# EAGLE design controllerM1 (EAGLE 7.6.0)
CNAME: timebox controller; CREVISION: 1.0; DESIGNER: volzo
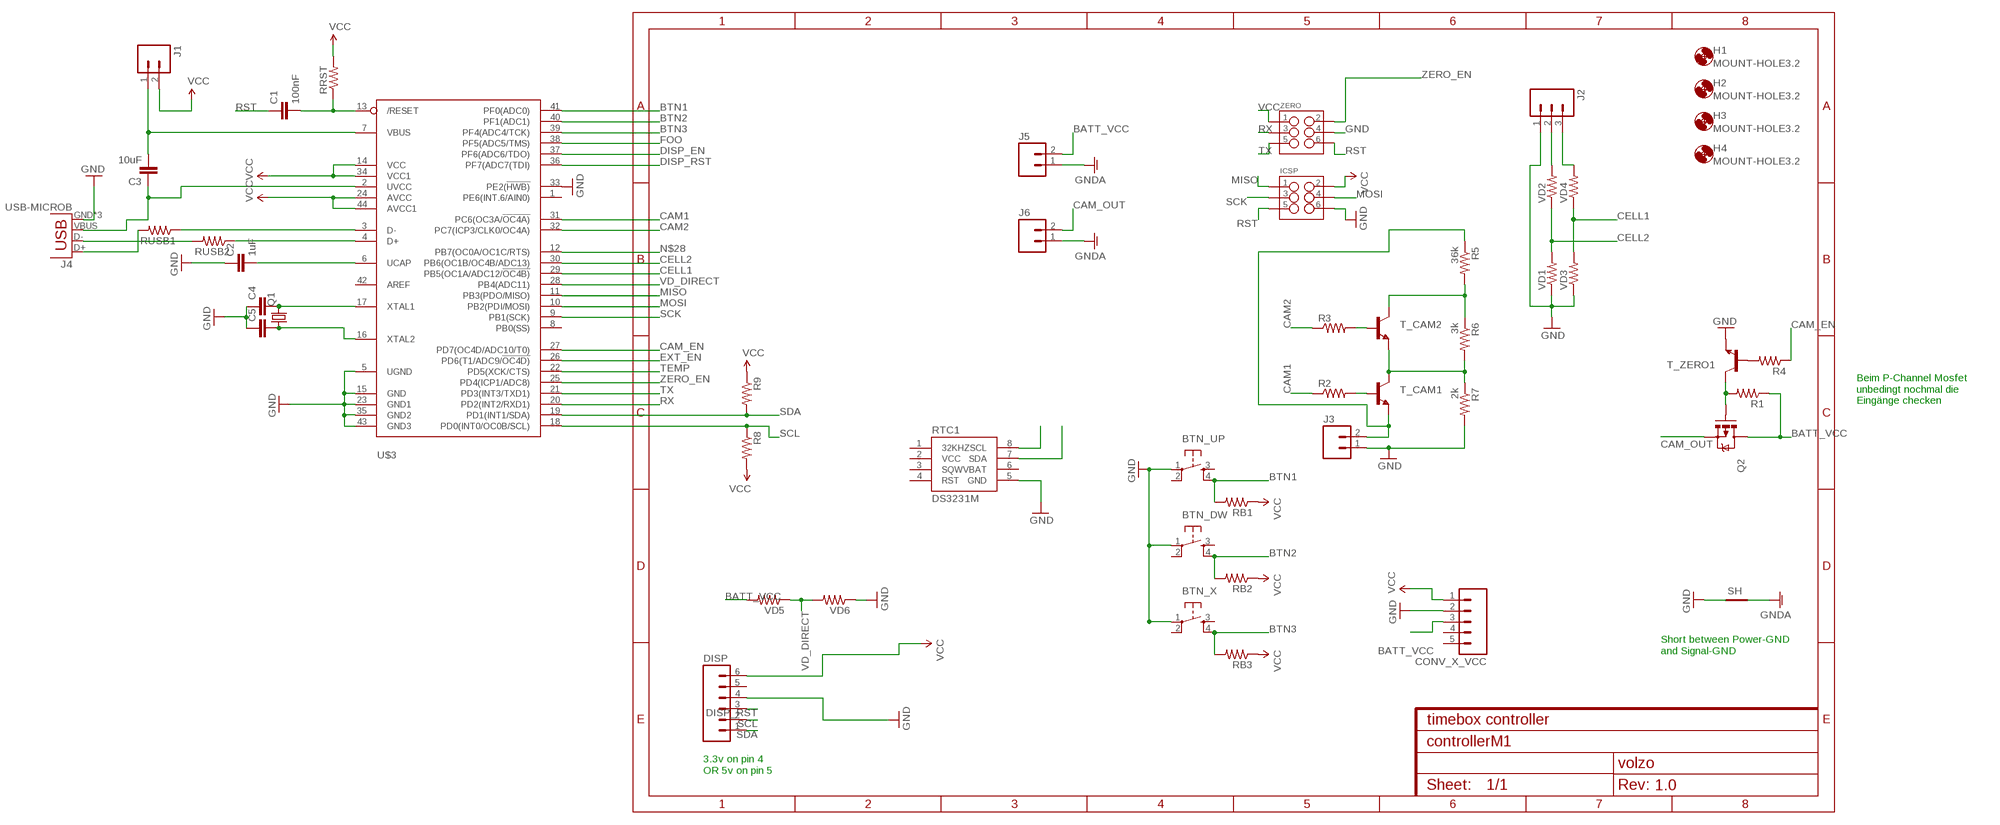
[diagram p0: schematic, sheet 1]

## Parts
BTN_DW  TAC_SWITCHPTH  [TACTILE-PTH]
BTN_UP  TAC_SWITCHPTH  [TACTILE-PTH]
BTN_X  TAC_SWITCHPTH  [TACTILE-PTH]
C1  100nF  CAP1206  [1206]
C2  1uF  CAP1206  [1206]
C3  10uF  CAP1206  [1206]
C4  CAP1206  [1206]
C5  CAP1206  [1206]
CONV_X_VCC  M05LOCK  [1X05_LOCK]
DISP  M06FEMALE_LOCK  [1X06_FEMALE_LOCK.010]
H1  MOUNT-HOLE3.2  [3,2]
H2  MOUNT-HOLE3.2  [3,2]
H3  MOUNT-HOLE3.2  [3,2]
H4  MOUNT-HOLE3.2  [3,2]
ICSP  M03X2FEMALE  [2X3]
J1  M02LOCK  [1X02_LOCK]
J2  M03LOCK  [1X03_LOCK]
J3  M02LOCK  [1X02_LOCK]
J4  USB-MICROB  [USB-MICROB]
J5  M023.5MM_LOCK  [SCREWTERMINAL-3.5MM-2_LOCK]
J6  M023.5MM_LOCK  [SCREWTERMINAL-3.5MM-2_LOCK]
Q1  CRYSTALHC49S  [HC49/S]
Q2  MOSFET-PCHANNELFQP27P06  [TO220V]
R1  RESISTOR1206  [1206]
R2  RESISTOR1206  [1206]
R3  RESISTOR1206  [1206]
R4  RESISTOR1206  [1206]
R5  36k  RESISTOR1206  [1206]
R6  3k  RESISTOR1206  [1206]
R7  2k  RESISTOR1206  [1206]
R8  RESISTOR1206  [1206]
R9  RESISTOR1206  [1206]
RB1  RESISTOR1206  [1206]
RB2  RESISTOR1206  [1206]
RB3  RESISTOR1206  [1206]
RRST  RESISTOR1206  [1206]
RTC1  DS3231M  [SOIC8]
RUSB1  RESISTOR1206  [1206]
RUSB2  RESISTOR1206  [1206]
SH  SHORT-HT5  [SHORT_TOP-50]
T_CAM1  TRANSISTOR_NPN2N3904  [TO-92]
T_CAM2  TRANSISTOR_NPN2N3904  [TO-92]
T_ZERO1  TRANSISTOR_NPN2N3904  [TO-92]
U$3  ATMEGA32U4-AU  [TQFP44]
VD1  RESISTOR1206  [1206]
VD2  RESISTOR1206  [1206]
VD3  RESISTOR1206  [1206]
VD4  RESISTOR1206  [1206]
VD5  RESISTOR1206  [1206]
VD6  RESISTOR1206  [1206]
ZERO  M03X2FEMALE  [2X3]

## Nets
BATT_VCC [power]: CONV_X_VCC.3 J5.2 Q2.2(D) R1.1 VD5.2
BTN1: BTN_UP.4 RB1.2 U$3.41(PF0(ADC0))
BTN2: BTN_DW.4 RB2.2 U$3.40(PF1(ADC1))
BTN3: BTN_X.4 RB3.2 U$3.39(PF4(ADC4/TCK))
CAM1: R2.1 U$3.31(PC6(OC3A/!OC4A))
CAM2: R3.1 U$3.32(PC7(ICP3/CLK0/OC4A))
CAM_EN: R4.1 U$3.27(PD7(OC4D/ADC10/T0))
CAM_OUT [power]: J6.2 Q2.3(S)
CELL1: U$3.29(PB5(OC1A/ADC12/!OC4B)) VD3.2 VD4.1
CELL2: U$3.30(PB6(OC1B/OC4B/ADC13)) VD1.2 VD2.1
DISP_EN: U$3.37(PF6(ADC6/TDO))
DISP_RST: DISP.3 U$3.36(PF7(ADC7(TDI))
EXT_EN: U$3.26(PD6(T1/ADC9/!OC4D))
FOO: U$3.38(PF5(ADC5/TMS))
GND: BTN_DW.1 BTN_UP.1 BTN_X.1 C2.1 C4.1 C5.1 CONV_X_VCC.2 DISP.4 ICSP.6 J2.1 J3.1 J4.GND J4.MT1(GND) J4.MT2(GND) R7.2 RTC1.5(GND) SH.1 T_ZERO1.1(E) U$3.5(UGND) U$3.15(GND) U$3.23(GND1) U$3.33(PE2(!HWB)) U$3.35(GND2) U$3.43(GND3) VD1.1 VD3.1 VD6.1 ZERO.4
GNDA [power]: J5.1 J6.1 SH.2
MISO: ICSP.1 U$3.11(PB3(PDO/MISO))
MOSI: ICSP.4 U$3.10(PB2(PDI/MOSI))
N$1: C1.2 RRST.1 U$3.13(/RESET)
N$2: J2.3 VD4.2
N$3: J2.2 VD2.2
N$4: RUSB1.1 U$3.3(D-)
N$5: RUSB2.1 U$3.4(D+)
N$6: J3.2 R5.1 T_CAM1.1(E)
N$7: R4.2 T_ZERO1.2(B)
N$8: C4.2 Q1.2 U$3.17(XTAL1)
N$9: C5.2 Q1.1 U$3.16(XTAL2)
N$10: C3.2 J1.1 U$3.7(VBUS)
N$12: R6.2 R7.1 T_CAM1.3(C) T_CAM2.1(E)
N$13: R5.2 R6.1 T_CAM2.3(C)
N$14: J4.D+ RUSB1.2
N$15: J4.D- RUSB2.2
N$18: R2.2 T_CAM1.2(B)
N$19: R3.2 T_CAM2.2(B)
N$20: C2.2 U$3.6(UCAP)
N$21: Q2.1(G) R1.2 T_ZERO1.3(C)
N$22: C3.1 J4.VBUS U$3.2(UVCC)
N$28: U$3.12(PB7(OC0A/OC1C/RTS))
RST: C1.1 ICSP.5 ZERO.6
RX: U$3.20(PD2(INT2/RXD1)) ZERO.3
SCK: ICSP.3 U$3.9(PB1(SCK))
SCL: DISP.2 R8.1 RTC1.8(SCL) U$3.18(PD0(INT0/OC0B/SCL))
SDA: DISP.1 R9.2 RTC1.7(SDA) U$3.19(PD1(INT1/SDA))
TEMP: U$3.22(PD5(XCK/CTS))
TX: U$3.21(PD3(INT3/TXD1)) ZERO.5
VCC: CONV_X_VCC.1 DISP.6 ICSP.2 J1.2 R8.2 R9.1 RB1.1 RB2.1 RB3.1 RRST.2 U$3.14(VCC) U$3.24(AVCC) U$3.34(VCC1) U$3.44(AVCC1) ZERO.1
VD_DIRECT: U$3.28(PB4(ADC11)) VD5.1 VD6.2
ZERO_EN: U$3.25(PD4(ICP1/ADC8)) ZERO.2
Unconnected: BTN_DW.2 BTN_DW.3 BTN_UP.2 BTN_UP.3 BTN_X.2 BTN_X.3 CONV_X_VCC.4 CONV_X_VCC.5 DISP.5 RTC1.1(32KHZ) RTC1.3(SQW) RTC1.4(RST) U$3.1(PE6(INT.6/AIN0)) U$3.8(PB0(SS)) U$3.42(AREF)

## Notes on the sheet
- Beim P-Channel Mosfet
  unbedingt nochmal die 
  Eingänge checken
- Short between Power-GND
  and Signal-GND
- 3.3v on pin 4
  OR 5v on pin 5

## Power pins joined to a net without a drawn wire
VBAT: RTC1.6(VBAT)
VCC: RTC1.2(VCC)

## Library data of the parts
BTN_DW BTN_UP BTN_X = SparkFun-Retired:TAC_SWITCH: Momentary Switch Button commonly used for reset or general input. Spark Fun Electronics SKU : COM-00097 SMT- SWCH-08247
C1 C3-C5 = SparkFun-Passives:CAP: Capacitor Standard 0603 ceramic capacitor, and 0.1" leaded capacitor.
C2 = SparkFun-Capacitors:CAP: Capacitor Standard 0603 ceramic capacitor, and 0.1" leaded capacitor.
CONV_X_VCC = SparkFun-Connectors:M05: Header 5 Standard 5-pin 0.1" header. Use with straight break away headers (SKU : PRT-00116), right angle break away headers (PRT-00553), swiss pins (PRT-00743), machine pins (PRT-00117), and female headers (PRT-00115). Molex polarized connector foot print use with SKU : PRT-08230 with associated crimp pins and housings.
DISP = SparkFun-Connectors:M06: Header 6 Standard 6-pin 0.1" header. Use with straight break away headers (SKU : PRT-00116), right angle break away headers (PRT-00553), swiss pins (PRT-00743), machine pins (PRT-00117), and female headers (PRT-00115). Molex polarized connector foot print use with SKU : PRT-08094 with associated crimp pins and housings. NOTES ON THE VARIANTS LOCK and LOCK_LONGPADS... This footprint was designed to help hold the alignment of a through-hole component (i.e. 6-pin header) while soldering it into place. You may notice that each hole has been shifted either up or down by 0.005 of an inch from it's more standard position (which is a perfectly straight line). This slight alteration caused the pins (the squares in the middle) to touch the edges of the holes. Because they are alternating, it causes a "brace" to hold the component in place. 0.005 has proven to be the perfect amount of "off-center" position when using our standard breakaway headers. Although looks a little odd when you look at the bare footprint, once you have a header in there, the alteration is very hard to notice. Also,if you push a header all the way into place, it is covered up entirely on the bottom side. This idea of altering the position of holes to aid alignment will be further integrated into the Sparkfun Library for other footprints. It can help hold any component with 3 or more connection pins.
H1-H4 = holes:MOUNT-HOLE: MOUNTING HOLE with drill center marker
ICSP ZERO = SparkFun-Connectors:M03X2: 2x3 .1" header. Shrouded, with keying- CONN-10681 SMT- CONN-11415 Pogo pins- HW-11044; PROD_ID: CONN-11566; VALUE: FEMALE 2x3
J1 J3 = SparkFun-Connectors:M02: Standard 2-pin 0.1" header. Use with - straight break away headers ( PRT-00116) - right angle break away headers (PRT-00553) - swiss pins (PRT-00743) - machine pins (PRT-00117) - female headers (PRT-00115) Molex polarized connector foot print use with: PRT-08233 with associated crimp pins and housings. 2.54_SCREWTERM for use with PRT-10571. 3.5mm Screw Terminal footprints for PRT-08084 5mm Screw Terminal footprints for use with PRT-08432
J2 = SparkFun-Connectors:M03: Header 3 Standard 3-pin 0.1" header. Use with straight break away headers (SKU : PRT-00116), right angle break away headers (PRT-00553), swiss pins (PRT-00743), machine pins (PRT-00117), and female headers (PRT-00115). Molex polarized connector foot print use with SKU : PRT-08232 with associated crimp pins and housings.
J4 = SparkFun-Connectors:USB: USB Connectors USB-B-PTH is fully proven SKU : PRT-00139/CONN-08278 USB-miniB is fully proven SKU : PRT-00587 USB-A-PCB is untested. USB-A-H is throughly reviewed, but untested. Spark Fun Electronics SKU : PRT-00437 USB-B-SMT is throughly reviewed, but untested. Needs silkscreen touching up. USB-A-S has not been used/tested USB-MB-H has not been used/tested USB-MICROB has been used. CONN-09505; PROD_ID: CONN-09505
J5 J6 = SparkFun-Connectors:M02: Standard 2-pin 0.1" header. Use with - straight break away headers ( PRT-00116) - right angle break away headers (PRT-00553) - swiss pins (PRT-00743) - machine pins (PRT-00117) - female headers (PRT-00115) Molex polarized connector foot print use with: PRT-08233 with associated crimp pins and housings. 2.54_SCREWTERM for use with PRT-10571. 3.5mm Screw Terminal footprints for PRT-08084 5mm Screw Terminal footprints for use with PRT-08432; PROD_ID: CONN-08399
Q1 = adafruit:CRYSTAL: CRYSTAL; OC_FARNELL: 1667008; OC_NEWARK: unknown
Q2 = SparkFun-DiscreteSemi:MOSFET-PCHANNEL: Generic PMOSFET IRLML2244 - TRANS-11153 (SOT-23 -20V -4.3A) (1.Gate 2.Source 3.Drain) FQP27P06 - COM-10349 <http://www.sparkfun.com/products/10349> (TO-220 -60V -27A) (1.Gate 2.Source 3.Drain)
R1-R9 RB1-RB3 RRST RUSB1 RUSB2 VD1-VD6 = SparkFun-Passives:RESISTOR: Resistor Basic schematic elements and footprints for 0603, 1206, and PTH resistors.
RTC1 = SparkFun-DigitalIC:DS3231M: DS3231M Real Time Clock. Accuracy +/-5ppm. Battery Backup. 2.3V to 5.5V.; PROD_ID: IC-11985
SH = shorts-old:SHORT-H: Short between two nets; BOM: no
T_CAM1 T_CAM2 T_ZERO1 = SparkFun-DiscreteSemi:TRANSISTOR_NPN: Generic NPN BJT MMBT2222A - TRANS-08049 (SOT-23, 1A 40V) MPSA42 - TRANS-09116 (SOT-23, 500mA 300V) MMBT5088LT1G - TRANS-11160 (SOT-23, 50 mA 30V) BC547 - COM-08928 <http://www.sparkfun.com/products/8928> (TO-92 45V 100mA) (1.Collector 2.Base 3.Emitter) 2N3904 - COM-00521 <http://www.sparkfun.com/products/521> (TO-92 40V 200mA) (1.Emitter 2.Base 3.Collector) P2N2222A - COM-12852 <http://www.sparkfun.com/products/12852> (TO-92 40V 600mA) (1.Collector 2.Base 3.Emitter); PROD_ID: TRANS-08447
U$3 = adafruit:ATMEGA32U4: http://www.ladyada.net/library/eagle

## Net classes
0 default: width 0.254 mm
1 power: width 0.762 mm, clearance 0.254 mm

## Board
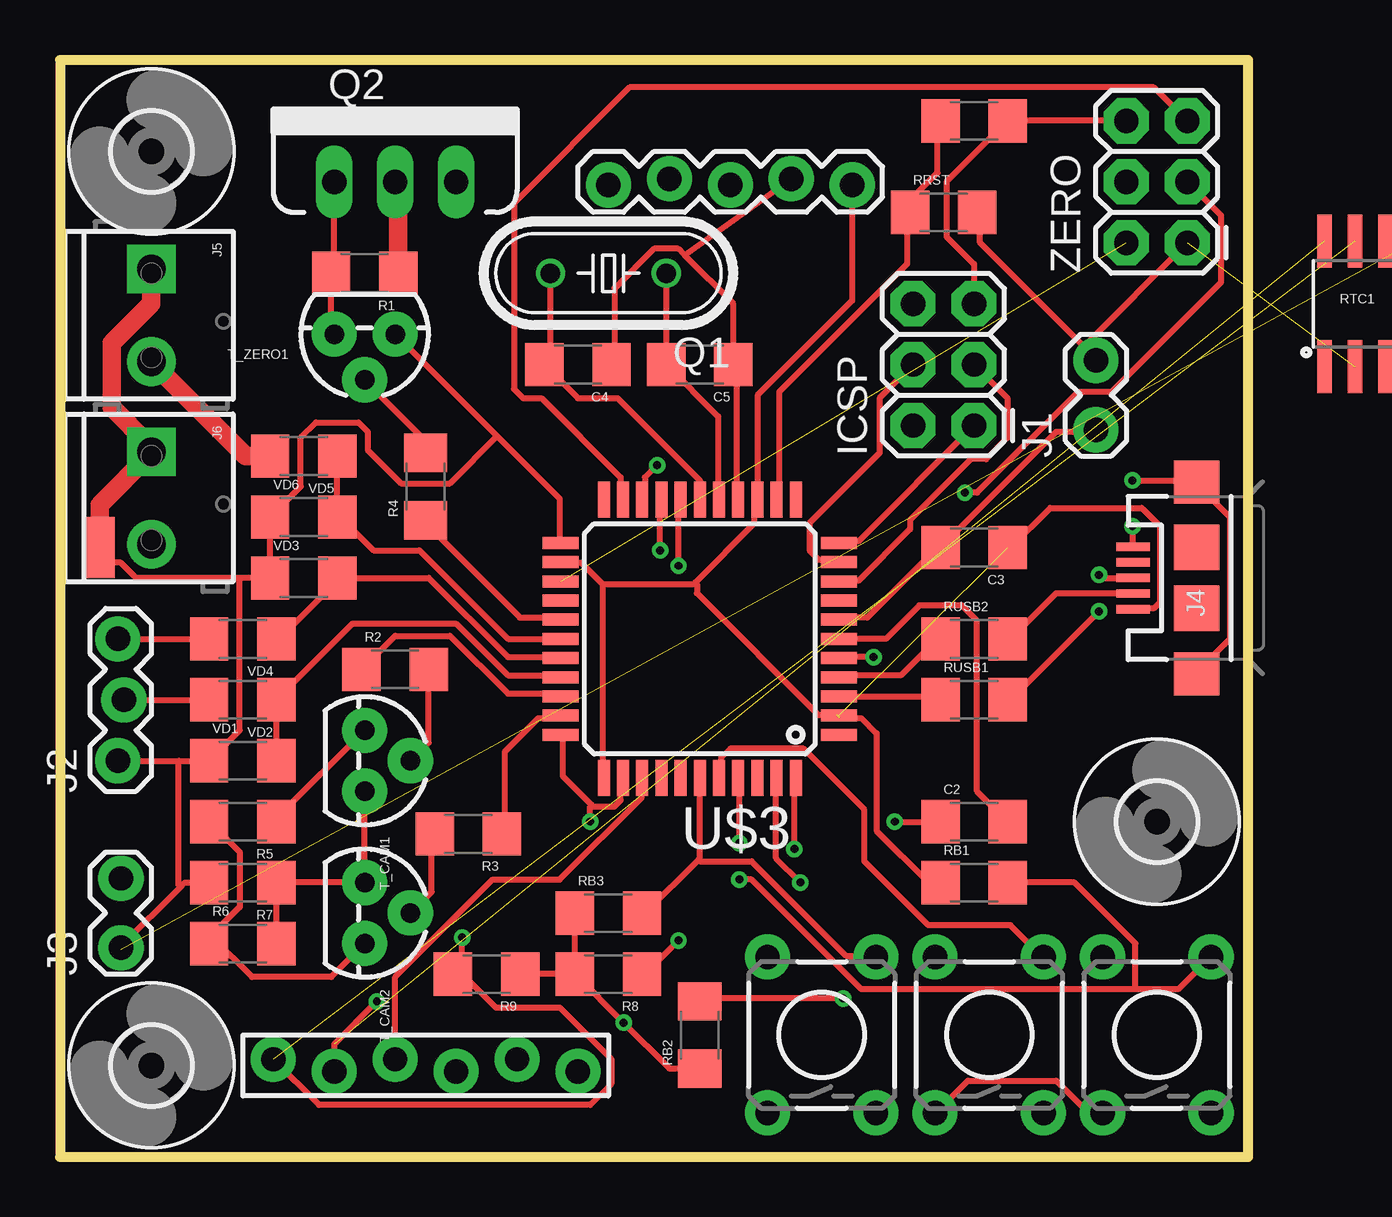
[diagram p1: board, top side]
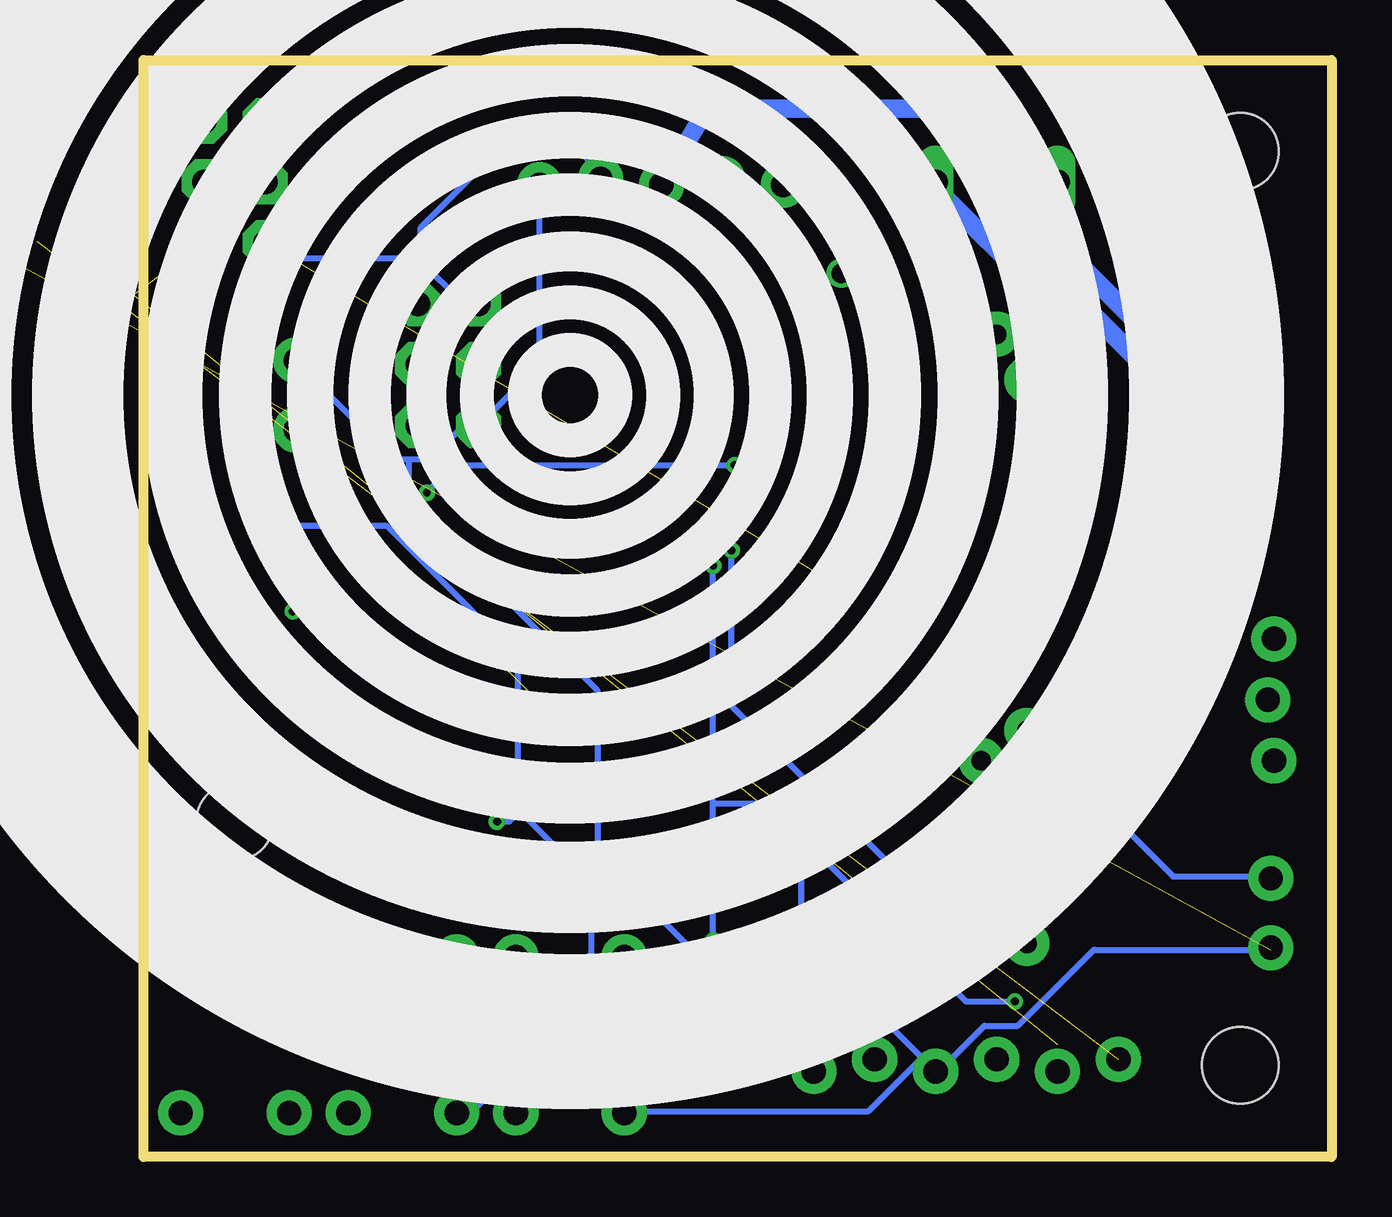
[diagram p2: board, bottom side, seen from below]

Size 49.53 x 45.72 mm. Coordinates in mm from the lower left corner, seen from the top.
Outline: 0,0 49.53,0 49.53,45.72 0,45.72 0,0
Copper layers (1*16): Top 0.0356mm / dielectric 1.5011mm / Bottom 0.0356mm
Design rules "oshpark-2layer *": minimum track width 6mil, minimum drill 13mil, track to track 10mil, track to pad 10mil, pad to pad 10mil, via to via 10mil, smd to smd 10mil, copper to edge 15mil, drill to drill 6mil, minimum pad ring 7mil, minimum via ring 7mil, stop-mask expansion 2.5mil, vias tented up to drill 0mil, thermal gap 10mil

### Footprints (pad centres in the part's own frame; a part is rotated, then mirrored left to right if it is on the bottom)
TACTILE-PTH = drill 1.016 pad 1.88: 1 -3.251,2.261; 2 3.251,2.261; 3 -3.251,-2.261; 4 3.251,-2.261
1206 = smd 1.6 x 1.8: 1 -1.4,0; 2 1.4,0
1X05_LOCK = drill 1.016 pad 1.88: 1 0,0.127; 2 2.54,-0.127; 3 5.08,0.127; 4 7.62,-0.127; 5 10.16,0.127
1X06_FEMALE_LOCK.010 = drill 1.016 pad 1.88: 1 0,0.254; 2 2.54,-0.254; 3 5.08,0.254; 4 7.62,-0.254; 5 10.16,0.254; 6 12.7,-0.254
3,2 = hole 3.2: 0,0
2X3 = drill 1.016 pad 1.88 octagon: 1 0,0; 2 0,2.54; 3 2.54,0; 4 2.54,2.54; 5 5.08,0; 6 5.08,2.54
1X02_LOCK = drill 1.016 pad 1.88: 1 -0.178,0; 2 2.718,0
1X03_LOCK = drill 1.016 pad 1.88: 1 0,0.127; 2 2.54,-0.127; 3 5.08,0.127
USB-MICROB = smd 0.35 x 1.4: D+ 0,2.65; D- -0.65,2.65; GND 1.3,2.65; ID 0.65,2.65; VBUS -1.3,2.65 | smd 1.8 x 1.9: MT1 -4,0; MT2 4,0 | smd 1.9 x 1.9: P$1 -1.27,0; P$2 1.27,0
SCREWTERMINAL-3.5MM-2_LOCK = drill 1.2 pad 2.032 square: 1 -0.178,0 | drill 1.2 pad 2.032: 2 3.678,0
HC49/S = drill 0.813: 1 -2.413,0; 2 2.413,0
TO220V = drill 1.016 long: 1 -2.54,0; 2 0,0; 3 2.54,0
SOIC8 = smd 0.61 x 2.21: 1 -1.905,-2.616; 2 -0.635,-2.616; 3 0.635,-2.616; 4 1.905,-2.616; 5 1.905,2.616; 6 0.635,2.616; 7 -0.635,2.616; 8 -1.905,2.616
SHORT_TOP-50 = smd 1.27 x 1.27: 1 0.635,0; 2 -0.635,0
TO-92 = drill 0.813 pad 1.88: 1 -1.27,0; 2 0,1.905; 3 1.27,0
TQFP44 = smd 1.5 x 0.5: 1 -5.8,4; 2 -5.8,3.2; 3 -5.8,2.4; 4 -5.8,1.6; 5 -5.8,0.8; 6 -5.8,0; 7 -5.8,-0.8; 8 -5.8,-1.6; 9 -5.8,-2.4; 10 -5.8,-3.2; 11 -5.8,-4; 23 5.8,-4; 24 5.8,-3.2; 25 5.8,-2.4; 26 5.8,-1.6; 27 5.8,-0.8; 28 5.8,0; 29 5.8,0.8; 30 5.8,1.6; 31 5.8,2.4; 32 5.8,3.2; 33 5.8,4 | smd 0.5 x 1.5: 12 -4,-5.8; 13 -3.2,-5.8; 14 -2.4,-5.8; 15 -1.6,-5.8; 16 -0.8,-5.8; 17 0,-5.8; 18 0.8,-5.8; 19 1.6,-5.8; 20 2.4,-5.8; 21 3.2,-5.8; 22 4,-5.8; 34 4,5.8; 35 3.2,5.8; 36 2.4,5.8; 37 1.6,5.8; 38 0.8,5.8; 39 0,5.8; 40 -0.8,5.8; 41 -1.6,5.8; 42 -2.4,5.8; 43 -3.2,5.8; 44 -4,5.8

### Placement (x,y rotation side)
BTN_DW  38.73,5.08 90 top
BTN_UP  45.72,5.08 90 top
BTN_X  31.75,5.08 90 top
C1  38.1,43.18 180 top
C2  38.1,13.97 0 top
C3  38.1,25.4 180 top
C4  21.59,33.02 180 top
C5  26.67,33.02 180 top
CONV_X_VCC  33.02,40.64 180 top
DISP  8.89,3.81 0 top
H1  3.81,41.91 0 top
H2  45.72,13.97 0 top
H3  69.85,27.94 0 top  (outside the outline)
H4  3.81,3.81 0 top
ICSP  38.1,30.48 90 top
J1  43.18,30.48 90 top
J2  2.54,16.51 90 top
J3  2.54,8.89 90 top
J4  47.37,24.13 90 top
J5  3.81,36.83 270 top
J6  3.81,29.21 270 top
Q1  22.86,36.83 180 top
Q2  13.97,40.64 0 top
R1  12.7,36.83 180 top
R2  13.97,20.32 0 top
R3  17.02,13.46 180 top
R4  15.24,27.94 90 top
R5  7.62,13.97 180 top
R6  7.62,8.89 0 top
R7  7.62,11.43 180 top
R8  22.86,7.62 180 top
R9  17.78,7.62 180 top
RB1  38.1,11.43 0 top
RB2  26.67,5.08 90 top
RB3  22.86,10.16 0 top
RRST  36.83,39.37 0 top
RTC1  54.61,35.56 0 top  (outside the outline)
RUSB1  38.1,19.05 0 top
RUSB2  38.1,21.59 0 top
SH  1.65,25.4 270 top
T_CAM1  12.7,16.51 270 top
T_CAM2  12.7,10.16 270 top
T_ZERO1  12.7,34.29 180 top
U$3  26.67,21.59 180 top
VD1  7.62,16.51 0 top
VD2  7.62,19.05 180 top
VD3  10.16,24.13 0 top
VD4  7.62,21.59 180 top
VD5  10.16,29.21 180 top
VD6  10.16,26.67 0 top
ZERO  46.99,38.1 90 top

### Tracks (layer width: path | path; a pad name or v marks a point on that pad's centre or on a via)
BATT_VCC
  Top 0.762: VD5.2 7.75,29.21 J5.2 | Q2.2 14.1,40.51 R1.1
  Bottom 0.762: CONV_X_VCC.3 26.04,43.69 16.76,43.69 13.97,40.89 Q2.2 13.97,40.39 12.06,38.48 11.81,38.48 6.6,33.27 3.81,33.27 J5.2
BTN1  (via drill 0.33)
  Top 0.254: v28.32,13.08 28.32,15.75 U$3.41 | v28.32,11.56 28.83,11.56 33.4,6.99 44.83,6.99 | 44.83,6.99 46.61,6.99 47.88,8.26 BTN_UP.4 | RB1.2 42.29,11.43 44.83,8.89 44.83,6.99
  Bottom 0.254: v28.32,11.56 v28.32,13.08
BTN2  (via drill 0.33)
  Top 0.254: U$3.40 27.56,15.88 27.56,16.64 27.94,17.02 30.99,17.02 33.53,14.48 33.53,12.32 36.2,9.65 39.62,9.65 40.89,8.38 BTN_DW.4 | v32.64,6.6 26.67,6.6 RB2.2
  Bottom 0.254: v32.64,6.6 39.24,6.6 40.89,8.26 BTN_DW.4
BTN3
  Top 0.254: U$3.39 26.67,12.45 26.61,12.38 | 26.61,12.38 24.38,10.16 RB3.2 | BTN_X.4 33.91,8.38 32.77,8.38 28.83,12.32 26.67,12.32 26.61,12.38
CAM1
  Top 0.254: U$3.31 20.83,19.3 18.67,19.3 16.26,21.72 13.97,21.72 R2.1
CAM2
  Top 0.254: U$3.32 20.83,18.29 19.94,18.29 18.54,16.89 18.54,13.46 R3.1
CAM_EN
  Top 0.254: U$3.27 20.83,22.48 19.18,22.48 15.24,26.42 R4.1
CAM_OUT
  Bottom 0.762: Q2.3 16.51,40.39 12.06,35.94 10.79,35.94 5.46,30.61 5.46,27.3 3.81,25.65 J6.2
CELL1
  Top 0.254: 11.68,24.13 15.37,24.13 18.67,20.83 20.83,20.83 U$3.29 | 11.68,24.13 9.14,21.59 VD4.1 | 11.68,24.13 VD3.2
CELL2
  Top 0.254: VD2.1 12.19,22.23 16.51,22.23 18.67,20.07 20.83,20.07 U$3.30 | VD2.1 VD1.2 | VD2.1
DISP_RST
  Top 0.254: DISP.3 13.97,7.49 18.03,11.56 20.83,11.56 24.26,14.99 24.26,15.75 U$3.36
GND  (via drill 0.33)  (1 unrouted)
  Top 0.254: T_ZERO1.1 18.22,30.04 | 18.22,30.04 20.83,27.43 20.83,25.65 U$3.23 | SH.1 2.54,24.77 3.17,24.13 7.49,24.13 | 7.49,24.13 VD3.1 VD6.1 | J2.1 4.95,16.51 | 4.95,16.51 VD1.1 7.49,17.78 7.49,24.13 | R7.2 5.21,11.43 5.02,11.24 | 5.02,11.24 2.54,8.76 J3.1 | 4.95,16.51 4.95,11.3 5.02,11.24 | 18.22,30.04 16.26,28.07 14.22,28.07 12.83,29.46 12.83,30.23 12.45,30.61 10.67,30.61 10.03,29.97 10.03,27.94 VD6.1 | VD6.1 | U$3.15 28.19,27.43 28.19,33.02 C5.1 28.07,35.56 26.04,37.59 | 26.04,37.59 25.78,37.85 24.77,37.85 23.11,36.2 23.11,33.02 C4.1 | 26.04,37.59 CONV_X_VCC.2 | J4.MT1 47.37,20.19 48.77,21.59 48.77,26.67 47.37,28.07 J4.MT2 47.37,28.19 v44.7,28.19 | v44.7,26.29 44.7,25.53 J4.GND | 22.16,14.67 20.95,15.88 20.95,17.53 U$3.33 | 22.16,14.67 22.23,14.61 23.11,14.61 23.37,14.86 23.37,15.75 U$3.35 | v22.1,13.97 22.1,14.61 22.16,14.67 | v30.86,11.43 29.84,12.45 29.84,15.75 U$3.43 | v33.91,20.83 32.51,20.83 U$3.5 | v34.8,13.97 C2.1 | BTN_UP.1 43.43,1.91 42.8,1.91 41.53,3.17 37.85,3.17 36.58,1.91 BTN_DW.1
  Bottom 0.254: 43.12,37.53 43.05,37.59 43.05,39.24 ZERO.4 | 43.12,37.53 44.7,35.94 v44.7,28.19 v44.7,26.29 39.37,26.29 v33.91,20.83 33.91,14.48 33.85,14.41 | ICSP.6 36.2,35.56 38.04,37.4 | 38.04,37.4 38.1,37.47 43.05,37.47 43.12,37.53 | CONV_X_VCC.2 31.37,42.04 32.51,43.18 33.53,43.18 37.97,38.73 37.97,37.47 38.04,37.4 | v22.1,13.97 22.1,9.14 DISP.4 | 30.86,3.17 v30.86,11.43 33.85,14.41 | 30.86,3.17 29.59,1.91 BTN_X.1 29.46,1.91 19.3,1.91 17.14,4.06 DISP.4 | v34.8,13.97 34.29,13.97 33.85,14.41 | 30.86,3.17 34.54,3.17 35.81,1.91 36.45,1.91 BTN_DW.1 | J3.1 2.54,8.64 9.91,8.64 13.08,5.46 14.48,5.46 16.38,3.56 DISP.4
GNDA
  Top 0.762: SH.2 1.65,27.18 3.81,29.34 J6.1 3.68,29.72 2.16,31.24 2.16,33.91 3.81,35.56 J5.1
MISO
  Top 0.254: ICSP.1 33.27,25.65 32.51,25.65 U$3.11
MOSI
  Top 0.254: ICSP.4 34.16,31.62 34.16,29.34 31.24,26.42 31.24,25.27 31.62,24.89 32.38,24.89 U$3.10
N$1
  Top 0.254: U$3.13 29.97,27.43 29.97,31.88 35.31,37.21 35.31,39.37 RRST.1 35.43,39.88 36.58,41.02 36.58,43.18 C1.2
N$2
  Top 0.254: J2.3 VD4.2
N$3
  Top 0.254: J2.2 VD2.2
N$4
  Top 0.254: U$3.3 32.51,19.18 36.45,19.18 36.58,19.05 RUSB1.1
N$5
  Top 0.254: U$3.4 32.51,20.07 35.05,20.07 36.58,21.59 RUSB2.1
N$6
  Top 0.254: T_CAM1.1 9.14,14.22 9.14,13.97 R5.1
  Bottom 0.254: T_CAM1.1 6.6,11.68 2.54,11.68 J3.2
N$7
  Top 0.254: R4.2 15.24,29.84 T_ZERO1.2
N$8
  Top 0.254: U$3.17 26.67,28.19 23.24,31.62 21.59,31.62 C4.2 20.45,32.89 Q1.2
N$9
  Top 0.254: C5.2 27.43,30.86 27.43,27.43 U$3.16 | C5.2 Q1.1 | C5.2
N$10
  Top 0.254: U$3.7 32.51,22.48 33.66,22.48 36.58,25.4 C3.2 41.53,30.23 43.18,30.23 J1.1
N$12
  Top 0.254: R6.2 R7.1 T_CAM2.1 T_CAM1.3
N$13
  Top 0.254: R5.2 7.49,12.7 7.49,10.41 6.22,9.14 R6.1 6.35,9.14 8,7.49 11.3,7.49 T_CAM2.3
N$14  (via drill 0.33)
  Top 0.254: J4.D+ 43.43,24.13 v43.31,24.26 | v43.31,22.73 39.62,19.05 RUSB1.2
  Bottom 0.254: v43.31,22.73 v43.31,24.26
N$15
  Top 0.254: J4.D- 44.7,23.5 41.53,23.5 39.62,21.59 RUSB2.2
N$18
  Top 0.254: T_CAM1.2 15.37,17.27 R2.2
N$19
  Top 0.254: T_CAM2.2 15.49,11.05 15.49,13.46 R3.2
N$20
  Top 0.254: U$3.6 34.42,21.59 35.81,22.99 37.59,22.99 38.23,22.35 38.23,15.24 C2.2
N$21
  Top 0.254: R1.2 11.3,34.42 T_ZERO1.3 | Q2.1 11.43,36.96 R1.2 | R1.2
N$22  (1 unrouted)
  Top 0.254: J4.VBUS 44.83,22.86 45.59,22.86 45.85,23.11 45.85,26.29 45.09,27.05 41.27,27.05 39.62,25.4 C3.1
RST
  Top 0.254: ZERO.6 C1.1 36.96,40.64 36.96,38.35 38.1,37.21 ICSP.5
RX  (via drill 0.33)
  Top 0.254: v24.89,28.83 24.38,28.32 24.38,27.43 U$3.20 | v37.72,27.69 38.23,27.69 42.42,31.88 43.81,31.88 48.39,36.45 48.39,39.24 ZERO.3
  Bottom 0.254: v24.89,28.83 36.58,28.83 v37.72,27.69
SCK
  Top 0.254: ICSP.3 39.5,31.62 39.5,29.97 38.61,29.08 37.97,29.08 35.43,26.54 35.43,26.16 33.27,24 32.51,24 U$3.9
SCL  (via drill 0.33)  (1 unrouted)
  Top 0.254: v25.78,24.64 25.78,27.3 U$3.18 | v25.78,9.02 24.38,7.62 R8.1 | DISP.2 11.43,4.7 v13.21,6.48
  Bottom 0.254: v25.78,9.02 25.78,14.73 | 25.78,14.73 v25.78,24.64 | v13.21,6.48 15.24,6.48 21.34,12.57 21.34,14.35 21.72,14.73 25.78,14.73
SDA  (via drill 0.33)  (1 unrouted)
  Top 0.254: v25.02,25.27 25.02,27.3 U$3.19 | v16.76,9.14 16.76,8 R9.2 16.64,7.75 18.16,6.22 20.83,6.22 22.99,4.06 22.99,3.05 22.1,2.16 10.79,2.16 DISP.1
  Bottom 0.254: v25.02,25.27 25.02,18.8 16.76,10.54 v16.76,9.14
TX
  Top 0.254: ZERO.5 45.59,44.58 23.75,44.58 18.92,39.75 18.92,32 19.3,31.62 20.07,31.62 23.37,28.32 23.37,27.43 U$3.21
VCC  (via drill 0.33)  (2 unrouted)
  Top 0.254: 22.61,23.88 22.61,15.88 U$3.34 | 22.61,23.88 21.72,24.77 20.95,24.77 U$3.24 | 26.48,23.94 26.42,23.88 22.61,23.88 | 26.48,23.94 28.96,26.42 28.96,27.3 U$3.14 29.08,27.43 29.08,31.75 33.02,35.69 CONV_X_VCC.1 | 32.38,18.41 31.62,18.41 26.54,23.5 26.54,23.88 26.48,23.94 | RB1.1 36.2,11.43 34.04,13.59 34.04,17.65 33.4,18.29 32.51,18.29 | R9.1 R8.2 | R8.2 v23.5,5.59 25.4,3.68 RB2.1 | R8.2 RB3.1 | v30.61,12.83 30.61,15.75 U$3.44 | 42.67,33.78 43.18,33.27 J1.2 42.67,33.78 | 42.67,33.78 38.35,38.1 38.35,39.37 RRST.2 | 42.67,33.78 ZERO.1
  Bottom 0.254: DISP.6 23.56,5.52 | 23.56,5.52 30.61,12.57 v30.61,12.83 30.61,19.43 38.48,27.3 38.48,29.08 | v23.5,5.59 23.56,5.52 | 38.48,29.08 39.12,29.08 43.18,33.15 J1.2 | 38.48,29.08 37.59,29.08 36.2,30.48 ICSP.2 33.02,33.02 CONV_X_VCC.1
VD_DIRECT
  Top 0.254: U$3.28 18.67,21.59 14.99,25.27 13.08,25.27 11.68,26.67 VD6.2 VD5.1
ZERO_EN  (1 unrouted)

### Text on the board
tPlace: TIME | BOX